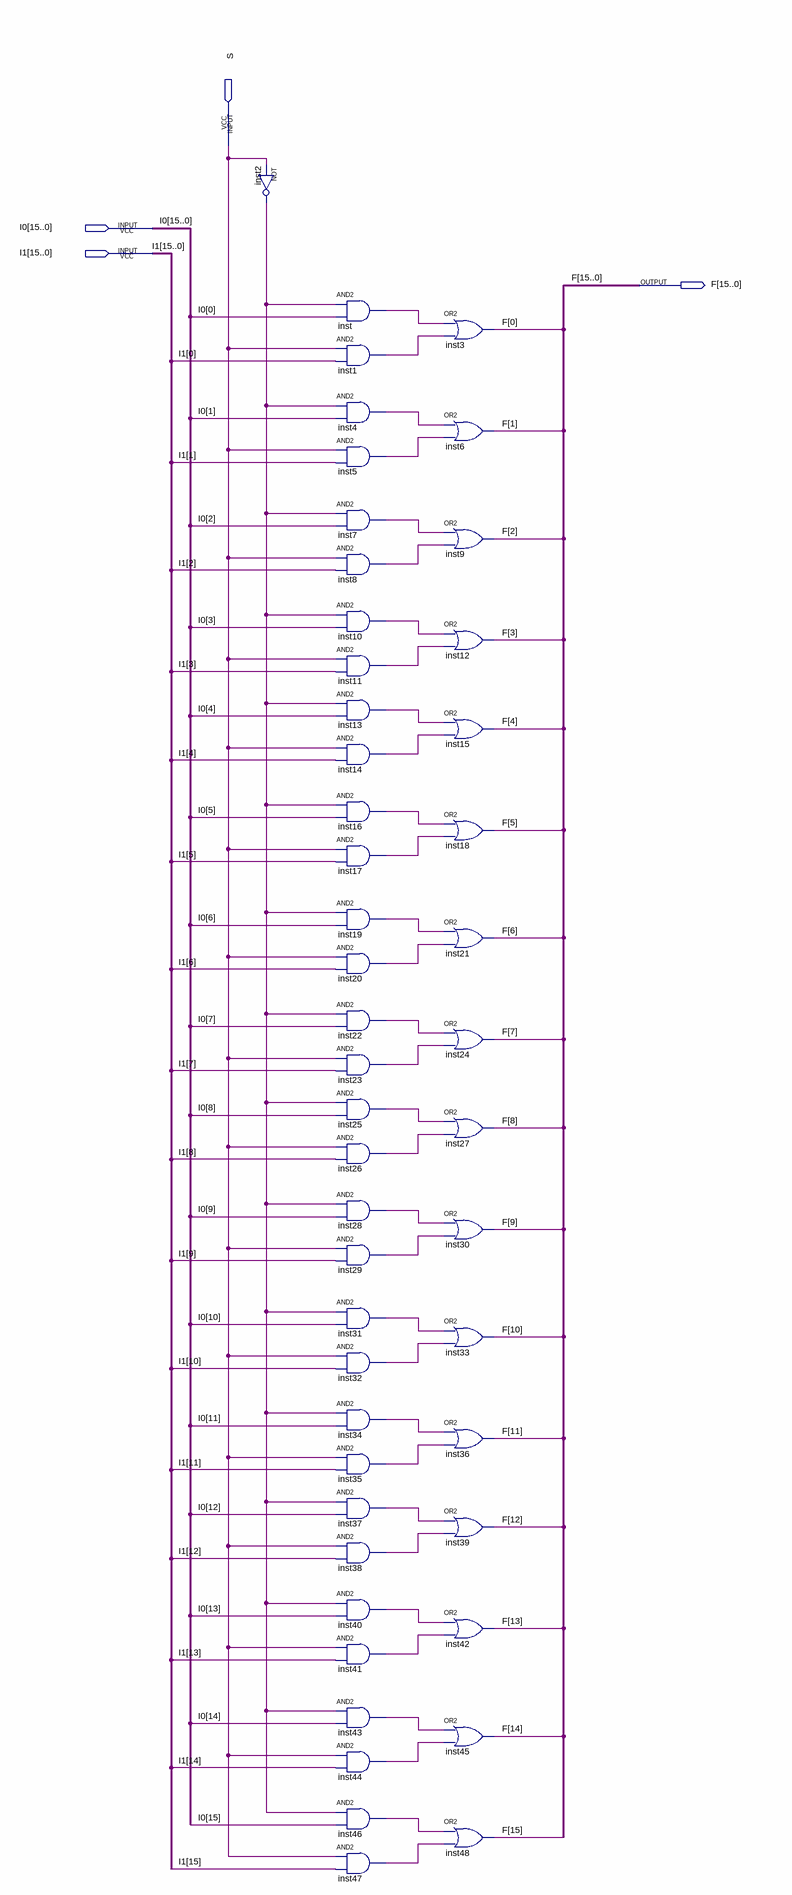
[diagram p0: schematic sheet]
// Quartus schematic 2by16Mux.bdf as structural Verilog: 49 symbols, 4 pins
module \2by16Mux  (
  input  S,
  input  [15:0] I0,
  input  [15:0] I1,
  output [15:0] F
);

  wire inst1_out, inst2_out, inst4_out, inst5_out, inst7_out, inst8_out, inst10_out, inst11_out, inst13_out,
       inst14_out, inst16_out, inst17_out, inst19_out, inst20_out, inst22_out, inst23_out, inst25_out,
       inst26_out, inst28_out, inst29_out, inst31_out, inst32_out, inst34_out, inst35_out, inst37_out,
       inst38_out, inst40_out, inst41_out, inst43_out, inst44_out, inst46_out, inst47_out, inst_out;

  not inst2 (inst2_out, S);
  and inst (inst_out, inst2_out, I0[0]);
  and inst1 (inst1_out, S, I1[0]);
  and inst4 (inst4_out, inst2_out, I0[1]);
  and inst5 (inst5_out, S, I1[1]);
  and inst7 (inst7_out, inst2_out, I0[2]);
  and inst8 (inst8_out, S, I1[2]);
  and inst10 (inst10_out, inst2_out, I0[3]);
  and inst11 (inst11_out, S, I1[3]);
  and inst13 (inst13_out, inst2_out, I0[4]);
  and inst14 (inst14_out, S, I1[4]);
  and inst16 (inst16_out, inst2_out, I0[5]);
  and inst17 (inst17_out, S, I1[5]);
  and inst19 (inst19_out, inst2_out, I0[6]);
  and inst20 (inst20_out, S, I1[6]);
  and inst22 (inst22_out, inst2_out, I0[7]);
  and inst23 (inst23_out, S, I1[7]);
  and inst25 (inst25_out, inst2_out, I0[8]);
  and inst26 (inst26_out, S, I1[8]);
  and inst28 (inst28_out, inst2_out, I0[9]);
  and inst29 (inst29_out, S, I1[9]);
  and inst31 (inst31_out, inst2_out, I0[10]);
  and inst32 (inst32_out, S, I1[10]);
  and inst34 (inst34_out, inst2_out, I0[11]);
  and inst35 (inst35_out, S, I1[11]);
  and inst37 (inst37_out, inst2_out, I0[12]);
  and inst38 (inst38_out, S, I1[12]);
  and inst40 (inst40_out, inst2_out, I0[13]);
  and inst41 (inst41_out, S, I1[13]);
  and inst43 (inst43_out, inst2_out, I0[14]);
  and inst44 (inst44_out, S, I1[14]);
  and inst46 (inst46_out, inst2_out, I0[15]);
  and inst47 (inst47_out, S, I1[15]);
  or inst3 (F[0], inst_out, inst1_out);
  or inst6 (F[1], inst4_out, inst5_out);
  or inst9 (F[2], inst7_out, inst8_out);
  or inst12 (F[3], inst10_out, inst11_out);
  or inst15 (F[4], inst13_out, inst14_out);
  or inst18 (F[5], inst16_out, inst17_out);
  or inst21 (F[6], inst19_out, inst20_out);
  or inst24 (F[7], inst22_out, inst23_out);
  or inst27 (F[8], inst25_out, inst26_out);
  or inst30 (F[9], inst28_out, inst29_out);
  or inst33 (F[10], inst31_out, inst32_out);
  or inst36 (F[11], inst34_out, inst35_out);
  or inst39 (F[12], inst37_out, inst38_out);
  or inst42 (F[13], inst40_out, inst41_out);
  or inst45 (F[14], inst43_out, inst44_out);
  or inst48 (F[15], inst46_out, inst47_out);
endmodule
